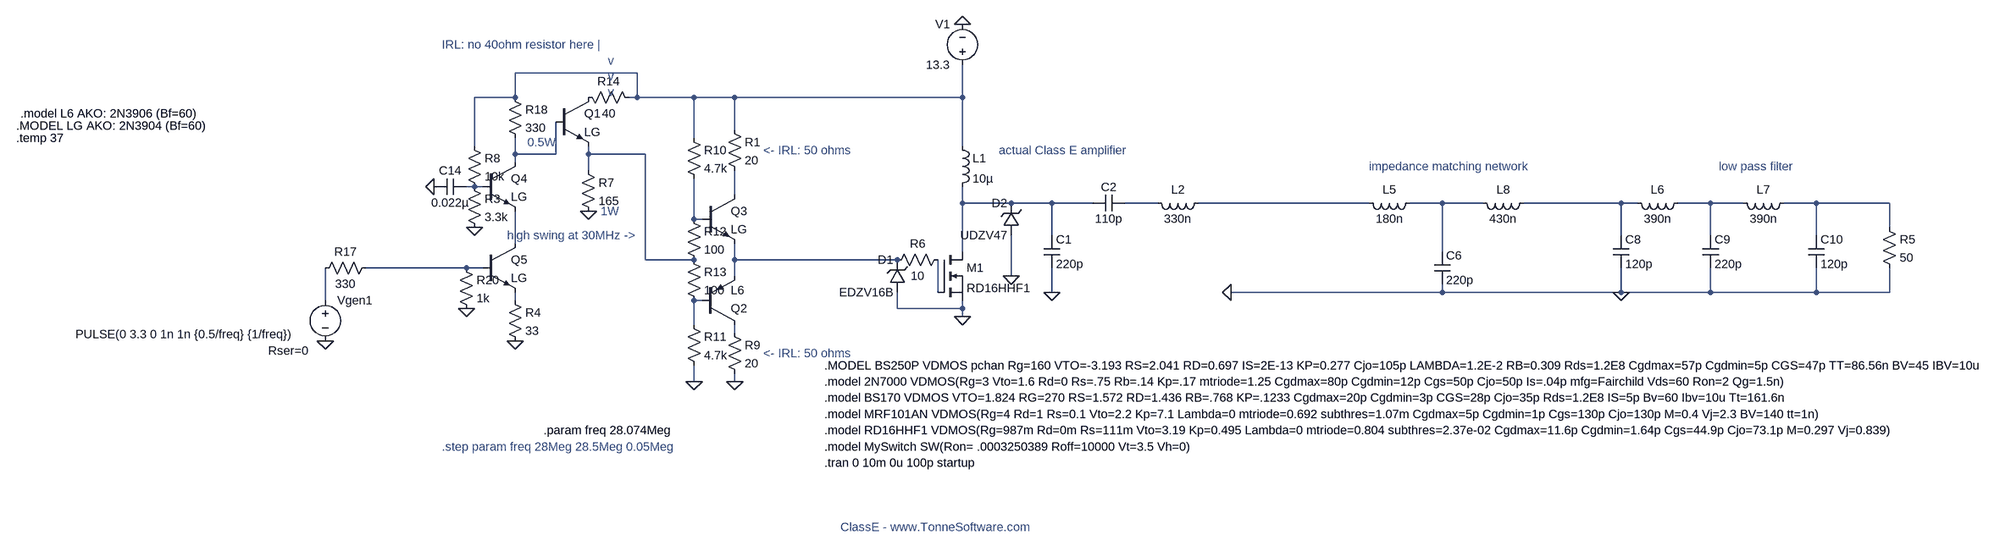
[diagram p0: schematic 28mhz_class_e_for_new_board.asc]
28mhz_class_e_for_new_board.asc, the LTspice schematic file:
Version 4
SHEET 1 2496 912
WIRE -368 -368 -608 -368
WIRE -608 -320 -608 -368
WIRE -608 -320 -688 -320
WIRE -368 -320 -368 -368
WIRE -368 -320 -384 -320
WIRE -256 -320 -368 -320
WIRE -176 -320 -256 -320
WIRE 272 -320 272 -384
WIRE 272 -320 -176 -320
WIRE -176 -256 -176 -320
WIRE -256 -240 -256 -320
WIRE -688 -224 -688 -320
WIRE 272 -224 272 -320
WIRE -608 -208 -608 -240
WIRE -528 -208 -528 -272
WIRE -528 -208 -608 -208
WIRE -464 -208 -464 -224
WIRE -352 -208 -464 -208
WIRE -608 -192 -608 -208
WIRE -464 -176 -464 -208
WIRE -688 -144 -704 -144
WIRE -672 -144 -688 -144
WIRE -176 -128 -176 -176
WIRE 272 -112 272 -144
WIRE 368 -112 272 -112
WIRE 448 -112 368 -112
WIRE 528 -112 448 -112
WIRE 656 -112 592 -112
WIRE 1072 -112 736 -112
WIRE 1216 -112 1152 -112
WIRE 1296 -112 1216 -112
WIRE 1568 -112 1376 -112
WIRE 1600 -112 1568 -112
WIRE 1744 -112 1680 -112
WIRE 1808 -112 1744 -112
WIRE 1952 -112 1888 -112
WIRE 2096 -112 1952 -112
WIRE -256 -80 -256 -160
WIRE -240 -80 -256 -80
WIRE 2096 -64 2096 -112
WIRE 448 -48 448 -112
WIRE 1568 -48 1568 -112
WIRE 1744 -48 1744 -112
WIRE 1952 -48 1952 -112
WIRE -608 -32 -608 -96
WIRE 272 -16 272 -112
WIRE 1216 -16 1216 -112
WIRE -352 0 -352 -208
WIRE -256 0 -352 0
WIRE -176 0 -176 -32
WIRE 144 0 -176 0
WIRE -704 16 -960 16
WIRE -672 16 -704 16
WIRE -176 32 -176 0
WIRE 368 32 368 -48
WIRE 224 64 224 0
WIRE 448 64 448 16
WIRE 1216 64 1216 48
WIRE 1216 64 800 64
WIRE 1568 64 1568 16
WIRE 1568 64 1216 64
WIRE 1744 64 1744 16
WIRE 1744 64 1568 64
WIRE 1952 64 1952 16
WIRE 1952 64 1744 64
WIRE 2096 64 2096 16
WIRE 2096 64 1952 64
WIRE -1040 80 -1040 16
WIRE -608 80 -608 64
WIRE -240 80 -256 80
WIRE 144 96 144 64
WIRE 272 96 272 80
WIRE 272 96 144 96
WIRE 272 112 272 96
WIRE -256 128 -256 80
WIRE -176 144 -176 128
WIRE -256 240 -256 208
WIRE -176 240 -176 224
FLAG 272 112 0
FLAG 448 64 0
FLAG 800 64 0
FLAG 1568 64 0
FLAG 272 -464 0
FLAG -1040 160 0
FLAG -704 96 0
FLAG -768 -144 0
FLAG -608 160 0
FLAG -464 -96 0
FLAG -688 -64 0
FLAG -176 240 0
FLAG -256 240 0
FLAG 368 32 0
SYMBOL ind 256 -240 R0
SYMATTR InstName L1
SYMATTR Value 10µ
SYMBOL cap 432 -48 R0
SYMATTR InstName C1
SYMATTR Value 220p
SYMBOL cap 592 -128 R90
WINDOW 0 0 32 VBottom 2
WINDOW 3 32 32 VTop 2
SYMATTR InstName C2
SYMATTR Value 110p
SYMBOL nmos 224 -16 R0
SYMATTR InstName M1
SYMATTR Value RD16HHF1
SYMBOL ind 1696 -128 R90
WINDOW 0 5 56 VBottom 2
WINDOW 3 32 56 VTop 2
SYMATTR InstName L6
SYMATTR Value 390n
SYMBOL ind 1904 -128 R90
WINDOW 0 5 56 VBottom 2
WINDOW 3 32 56 VTop 2
SYMATTR InstName L7
SYMATTR Value 390n
SYMBOL cap 1552 -48 R0
SYMATTR InstName C8
SYMATTR Value 120p
SYMBOL cap 1728 -48 R0
SYMATTR InstName C9
SYMATTR Value 220p
SYMBOL cap 1936 -48 R0
SYMATTR InstName C10
SYMATTR Value 120p
SYMBOL res 2080 -80 R0
SYMATTR InstName R5
SYMATTR Value 50
SYMBOL voltage 272 -368 R180
WINDOW 0 24 96 Left 2
WINDOW 3 24 16 Left 2
WINDOW 123 0 0 Left 0
WINDOW 39 0 0 Left 0
SYMATTR InstName V1
SYMATTR Value 13.3
SYMBOL voltage -1040 64 R0
WINDOW 123 24 132 Left 0
WINDOW 39 -112 115 Left 2
WINDOW 3 -491 83 Left 2
SYMATTR SpiceLine Rser=0
SYMATTR Value PULSE(0 3.3 0 1n 1n {0.5/freq} {1/freq})
SYMATTR InstName Vgen1
SYMBOL res -944 0 R90
WINDOW 0 0 56 VBottom 2
WINDOW 3 32 56 VTop 2
SYMATTR InstName R17
SYMATTR Value 330
SYMBOL npn -672 -192 R0
SYMATTR InstName Q4
SYMATTR Value LG
SYMBOL npn -672 -32 R0
SYMATTR InstName Q5
SYMATTR Value LG
SYMBOL res -624 -336 R0
SYMATTR InstName R18
SYMATTR Value 330
SYMATTR SpiceLine pwr=0.5
SYMBOL res -720 0 R0
SYMATTR InstName R20
SYMATTR Value 1k
SYMBOL cap -704 -160 R90
WINDOW 0 0 32 VBottom 2
WINDOW 3 32 32 VTop 2
SYMATTR InstName C14
SYMATTR Value 0.022µ
SYMBOL res -624 64 R0
SYMATTR InstName R4
SYMATTR Value 33
SYMBOL npn -528 -320 R0
SYMATTR InstName Q1
SYMATTR Value LG
SYMBOL res -480 -192 R0
SYMATTR InstName R7
SYMATTR Value 165
SYMATTR SpiceLine pwr=0.5
SYMBOL res -704 -160 R0
SYMATTR InstName R3
SYMATTR Value 3.3k
SYMBOL res -704 -240 R0
SYMATTR InstName R8
SYMATTR Value 10k
SYMBOL pnp -240 128 M180
SYMATTR InstName Q2
SYMATTR Value L6
SYMBOL npn -240 -128 R0
SYMATTR InstName Q3
SYMATTR Value LG
SYMBOL res -192 -272 R0
SYMATTR InstName R1
SYMATTR Value 20
SYMBOL res -192 128 R0
SYMATTR InstName R9
SYMATTR Value 20
SYMBOL res -272 -256 R0
SYMATTR InstName R10
SYMATTR Value 4.7k
SYMBOL res -272 112 R0
SYMATTR InstName R11
SYMATTR Value 4.7k
SYMBOL res -272 -96 R0
SYMATTR InstName R12
SYMATTR Value 100
SYMBOL res -272 -16 R0
SYMATTR InstName R13
SYMATTR Value 100
SYMBOL res -480 -336 M90
WINDOW 0 0 56 VBottom 2
WINDOW 3 32 56 VTop 2
SYMATTR InstName R14
SYMATTR Value 40
SYMBOL ind 752 -128 R90
WINDOW 0 5 56 VBottom 2
WINDOW 3 32 56 VTop 2
SYMATTR InstName L2
SYMATTR Value 330n
SYMBOL cap 1200 -16 R0
SYMATTR InstName C6
SYMATTR Value 220p
SYMBOL ind 1168 -128 R90
WINDOW 0 5 56 VBottom 2
WINDOW 3 32 56 VTop 2
SYMATTR InstName L5
SYMATTR Value 180n
SYMBOL ind 1392 -128 R90
WINDOW 0 5 56 VBottom 2
WINDOW 3 32 56 VTop 2
SYMATTR InstName L8
SYMATTR Value 430n
SYMBOL zener 160 64 R180
WINDOW 0 24 64 Left 2
WINDOW 3 24 0 Left 2
SYMATTR InstName D1
SYMATTR Value EDZV16B
SYMBOL zener 384 -48 R180
WINDOW 0 24 64 Left 2
WINDOW 3 24 0 Left 2
SYMATTR InstName D2
SYMATTR Value UDZV47
SYMBOL res 240 -16 R90
WINDOW 0 0 56 VBottom 2
WINDOW 3 32 56 VTop 2
SYMATTR InstName R6
SYMATTR Value 10
TEXT 0 368 Left 2 !.model MySwitch SW(Ron= .0003250389 Roff=10000 Vt=3.5 Vh=0)
TEXT 0 400 Left 2 !.tran 0 10m 0u 100p startup
TEXT 32 528 Left 2 ;ClassE - www.TonneSoftware.com
TEXT 0 336 Left 2 !.model RD16HHF1 VDMOS(Rg=987m Rd=0m Rs=111m Vto=3.19 Kp=0.495 Lambda=0 mtriode=0.804 subthres=2.37e-02 Cgdmax=11.6p Cgdmin=1.64p Cgs=44.9p Cjo=73.1p M=0.297 Vj=0.839)
TEXT 344 -216 Left 2 ;actual Class E amplifier
TEXT -552 336 Left 2 !.param freq 28.074Meg
TEXT -752 368 Left 2 ;.step param freq 28Meg 28.5Meg 0.05Meg
TEXT 1072 -184 Left 2 ;impedance matching network
TEXT 1760 -184 Left 2 ;low pass filter
TEXT 0 304 Left 2 !.model MRF101AN VDMOS(Rg=4 Rd=1 Rs=0.1 Vto=2.2 Kp=7.1 Lambda=0 mtriode=0.692 subthres=1.07m Cgdmax=5p Cgdmin=1p Cgs=130p Cjo=130p M=0.4 Vj=2.3 BV=140 tt=1n)
TEXT 0 272 Left 2 !.model BS170 VDMOS VTO=1.824 RG=270 RS=1.572 RD=1.436 RB=.768 KP=.1233 Cgdmax=20p Cgdmin=3p CGS=28p Cjo=35p Rds=1.2E8 IS=5p Bv=60 Ibv=10u Tt=161.6n
TEXT 0 240 Left 2 !.model 2N7000 VDMOS(Rg=3 Vto=1.6 Rd=0 Rs=.75 Rb=.14 Kp=.17 mtriode=1.25 Cgdmax=80p Cgdmin=12p Cgs=50p Cjo=50p Is=.04p mfg=Fairchild Vds=60 Ron=2 Qg=1.5n)
TEXT 0 208 Left 2 !.MODEL BS250P VDMOS pchan Rg=160 VTO=-3.193 RS=2.041 RD=0.697 IS=2E-13 KP=0.277 Cjo=105p LAMBDA=1.2E-2 RB=0.309 Rds=1.2E8 Cgdmax=57p Cgdmin=5p CGS=47p TT=86.56n BV=45 IBV=10u
TEXT -1648 -264 Left 2 !.MODEL LG AKO: 2N3904 (Bf=60)
TEXT -1648 -240 Left 2 !.temp 37
TEXT -440 -96 Left 2 ;1W
TEXT -584 -232 Left 2 ;0.5W
TEXT -624 -48 Left 2 ;high swing at 30MHz ->
TEXT -120 -216 Left 2 ;<- IRL: 50 ohms
TEXT -120 184 Left 2 ;<- IRL: 50 ohms
TEXT -752 -424 Left 2 ;IRL: no 40ohm resistor here |\n                                                 v\n                                                 v\n                                                 v
TEXT -1640 -288 Left 2 !.model L6 AKO: 2N3906 (Bf=60)

The netlist it stands for:
* 28mhz_class_e_for_new_board.asc
L1 N001 N006 10µ
C1 N006 0 220p
C2 N007 N006 110p
M1 N006 N017 0 0 RD16HHF1
L6 N011 N010 390n
L7 N012 N011 390n
C8 N010 0 120p
C9 N011 0 220p
C10 N012 0 120p
R5 N012 0 50
V1 N001 0 13.3
Vgen1 N018 0 PULSE(0 3.3 0 1n 1n {0.5/freq} {1/freq}) Rser=0
R17 N016 N018 330
Q4 N002 N004 N014 0 LG
Q5 N014 N016 N019 0 LG
R18 N001 N002 330 pwr=0.5
R20 N016 0 1k
C14 N004 0 0.022µ
R4 N019 0 33
Q1 P001 N002 N003 0 LG
R7 N003 0 165 pwr=0.5
R3 N004 0 3.3k
R8 N001 N004 10k
Q2 N021 N020 N015 0 L6
Q3 N005 N013 N015 0 LG
R1 N001 N005 20
R9 N021 0 20
R10 N001 N013 4.7k
R11 N020 0 4.7k
R12 N013 N003 100
R13 N003 N020 100
R14 P001 N001 40
L2 N008 N007 330n
C6 N009 0 220p
L5 N009 N008 180n
L8 N010 N009 430n
D1 0 N015 EDZV16B
D2 0 N006 UDZV47
R6 N017 N015 10
.model D D
.lib standard.dio
.model NPN NPN
.model PNP PNP
.lib standard.bjt
.model NMOS NMOS
.model PMOS PMOS
.lib standard.mos
.model MySwitch SW(Ron= .0003250389 Roff=10000 Vt=3.5 Vh=0)
.tran 0 10m 0u 100p startup
* ClassE - www.TonneSoftware.com
.model RD16HHF1 VDMOS(Rg=987m Rd=0m Rs=111m Vto=3.19 Kp=0.495 Lambda=0 mtriode=0.804 subthres=2.37e-02 Cgdmax=11.6p Cgdmin=1.64p Cgs=44.9p Cjo=73.1p M=0.297 Vj=0.839)
* actual Class E amplifier
.param freq 28.074Meg
* .step param freq 28Meg 28.5Meg 0.05Meg
* impedance matching network
* low pass filter
.model MRF101AN VDMOS(Rg=4 Rd=1 Rs=0.1 Vto=2.2 Kp=7.1 Lambda=0 mtriode=0.692 subthres=1.07m Cgdmax=5p Cgdmin=1p Cgs=130p Cjo=130p M=0.4 Vj=2.3 BV=140 tt=1n)
.model BS170 VDMOS VTO=1.824 RG=270 RS=1.572 RD=1.436 RB=.768 KP=.1233 Cgdmax=20p Cgdmin=3p CGS=28p Cjo=35p Rds=1.2E8 IS=5p Bv=60 Ibv=10u Tt=161.6n
.model 2N7000 VDMOS(Rg=3 Vto=1.6 Rd=0 Rs=.75 Rb=.14 Kp=.17 mtriode=1.25 Cgdmax=80p Cgdmin=12p Cgs=50p Cjo=50p Is=.04p mfg=Fairchild Vds=60 Ron=2 Qg=1.5n)
.MODEL BS250P VDMOS pchan Rg=160 VTO=-3.193 RS=2.041 RD=0.697 IS=2E-13 KP=0.277 Cjo=105p LAMBDA=1.2E-2 RB=0.309 Rds=1.2E8 Cgdmax=57p Cgdmin=5p CGS=47p TT=86.56n BV=45 IBV=10u
.MODEL LG AKO: 2N3904 (Bf=60)
.temp 37
* 1W
* 0.5W
* high swing at 30MHz ->
* <- IRL: 50 ohms
* <- IRL: 50 ohms
* IRL: no 40ohm resistor here |
*                                                  v
*                                                  v
*                                                  v
.model L6 AKO: 2N3906 (Bf=60)
.backanno
.end